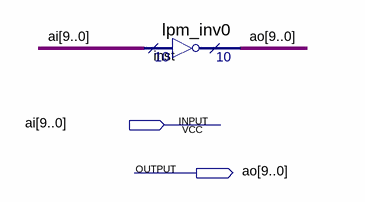
[diagram p0: schematic sheet]
// Quartus schematic fan.bdf as structural Verilog: 1 symbols, 2 pins
module fan (
  input  [9:0] ai,
  output [9:0] ao
);

  lpm_inv0 inst (.data(ai), .result(ao));
endmodule
